# EAGLE schematic micronucleus_usb_dev_stick (EAGLE 9.5.2)
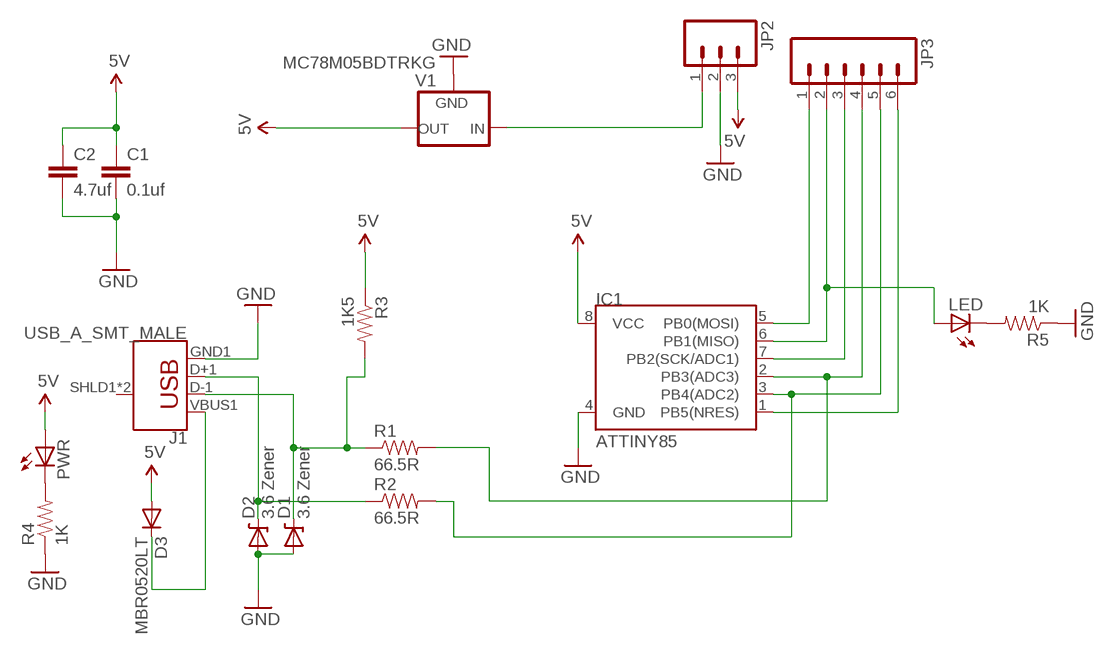
[diagram p0: schematic, sheet 1]

## Parts
C1  0.1uf  CAP0402-CAP  [0402-CAP]
C2  4.7uf  CAP0805  [0805]
D1  3.6 Zener  DIODE-ZENER-BZT52  [SOD-323]
D2  3.6 Zener  DIODE-ZENER-BZT52  [SOD-323]
D3  MBR0520LT  [SOD123]
IC1  ATTINY85  ATTINY45  [SO08-EIAJ]
J1  USB_A_SMT_MALE  [USB-A-SMT-MALE]
JP2  M03PTH  [1X03]
JP3  M06SIP  [1X06]
LED  LED0603  [LED-0603]
PWR  LED0603  [LED-0603]
R1  66.5R  RESISTOR0402-RES  [0402-RES]
R2  66.5R  RESISTOR0402-RES  [0402-RES]
R3  1K5  RESISTOR0402-RES  [0402-RES]
R4  1K  RESISTOR0402-RES  [0402-RES]
R5  1K  RESISTOR0402-RES  [0402-RES]
V1  MC78M05BDTRKG  LP2950CDT-3.0  [DPACK]

## Nets
5V: C1.1 C2.1 D3.A IC1.8(VCC) JP2.3 PWR.A R3.1 V1.3(OUT)
GND: C1.2 C2.2 D1.2(A) D2.2(A) IC1.4(GND) J1.GND1(GND) JP2.2 R4.1 R5.1 V1.4(GND)
N$1: IC1.2(PB3(ADC3)) JP3.4 R1.2
N$2: IC1.6(PB1(MISO)) JP3.2 LED.A
N$3: IC1.5(PB0(MOSI)) JP3.1
N$4: D3.C J1.VBUS1(VBUS)
N$5: IC1.7(PB2(SCK/ADC1)) JP3.3
N$6: IC1.3(PB4(ADC2)) JP3.5 R2.2
N$8: IC1.1(PB5(NRES)) JP3.6
N$10: D1.1(C) J1.D-1(D-) R1.1 R3.2
N$11: D2.1(C) J1.D+1(D+) R2.1
N$12: LED.C R5.2
N$15: JP2.1 V1.1(IN)
N$17: PWR.C R4.2
Unconnected: J1.SHLD1(SHIELD) J1.SHLD2(SHIELD)

## Library data of the parts
C1 C2 = SparkFun:CAP: Capacitor Standard 0603 ceramic capacitor, and 0.1" leaded capacitor.
D1 D2 = SparkFun:DIODE-ZENER: Zener Diode Production Part - 8199 3.4V Zener Voltage
D3 = diode:MBR0520LT: SCHOTTKY BARRIER RECTIFIER Source: http://onsemi.com .. MBR0520LT1-D.pdf
IC1 = SparkFun:ATTINY45: Atmel ATTiny45
J1 = SparkFun-Connectors:USB_A: USB-A Connector Male and female variants, as well as PTH and SMT variants SparkFun Products: SparkFun XBee Explorer Dongle <https://www.sparkfun.com/products/11697> PTH Male SparkFun MicroView-USB Programmer <https://www.sparkfun.com/products/12924> SMT Male SparkFun USB Type A Female Breakout <https://www.sparkfun.com/products/12700> SMT Female; PROD_ID: CONN-11499
JP2 = SparkFun:M03: Header 3 Standard 3-pin 0.1" header. Use with straight break away headers (SKU : PRT-00116), right angle break away headers (PRT-00553), swiss pins (PRT-00743), machine pins (PRT-00117), and female headers (PRT-00115). Molex polarized connector foot print use with SKU : PRT-08232 with associated crimp pins and housings.
JP3 = SparkFun:M06: Header 6 Standard 6-pin 0.1" header. Use with straight break away headers (SKU : PRT-00116), right angle break away headers (PRT-00553), swiss pins (PRT-00743), machine pins (PRT-00117), and female headers (PRT-00115). Molex polarized connector foot print use with SKU : PRT-08094 with associated crimp pins and housings. NOTES ON THE VARIANTS LOCK and LOCK_LONGPADS... This footprint was designed to help hold the alignment of a through-hole component (i.e. 6-pin header) while soldering it into place. You may notice that each hole has been shifted either up or down by 0.005 of an inch from it's more standard position (which is a perfectly straight line). This slight alteration caused the pins (the squares in the middle) to touch the edges of the holes. Because they are alternating, it causes a "brace" to hold the component in place. 0.005 has proven to be the perfect amount of "off-center" position when using our standard breakaway headers. Although looks a little odd when you look at the bare footprint, once you have a header in there, the alteration is very hard to notice. Also, if you push a header all the way into place, it is covered up entirely on the bottom side. This idea of altering the position of holes to aid alignment will be further integrated into the Sparkfun Library for other footprints. It can help hold any component with 3 or more connection pins.
LED PWR = SparkFun:LED: LEDs Standard schematic elements and footprints for 5mm, 3mm, 1206, and 0603 sized LEDs. 5mm - Spark Fun Electronics SKU : COM-00529 (and others)
R1-R5 = SparkFun:RESISTOR: Resistor Basic schematic elements and footprints for 0603, 1206, and PTH resistors.
V1 = v-reg:LP2950?*: Source: http://cache.national.com/ds/LP/LP2950.pdf